# Altium schematic sheet esquematico.SchDoc
size A4
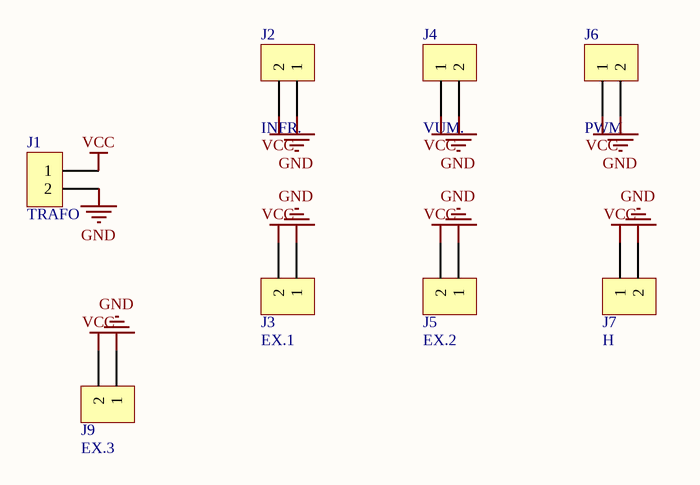
[diagram p0: esquematico.SchDoc]

## Parts
J1  TRAFO  [BORNERA2]
J2  INFR.  [BORNERA2]
J3  EX.1  [BORNERA2]
J4  VUM.  [BORNERA2]
J5  EX.2  [BORNERA2]
J6  PWM  [BORNERA2]
J7  H  [BORNERA2]
J9  EX.3  [BORNERA2]

## Nets
GND: J1.2 J2.1 J3.1 J4.2 J5.1 J6.2 J7.2 J9.1
VCC: J1.1 J2.2 J3.2 J4.1 J5.2 J6.1 J7.1 J9.2

## Library data of the parts
J1-J7 J9 = BORNERA 2